# EAGLE design External_Battery (EAGLE 9.2.0)
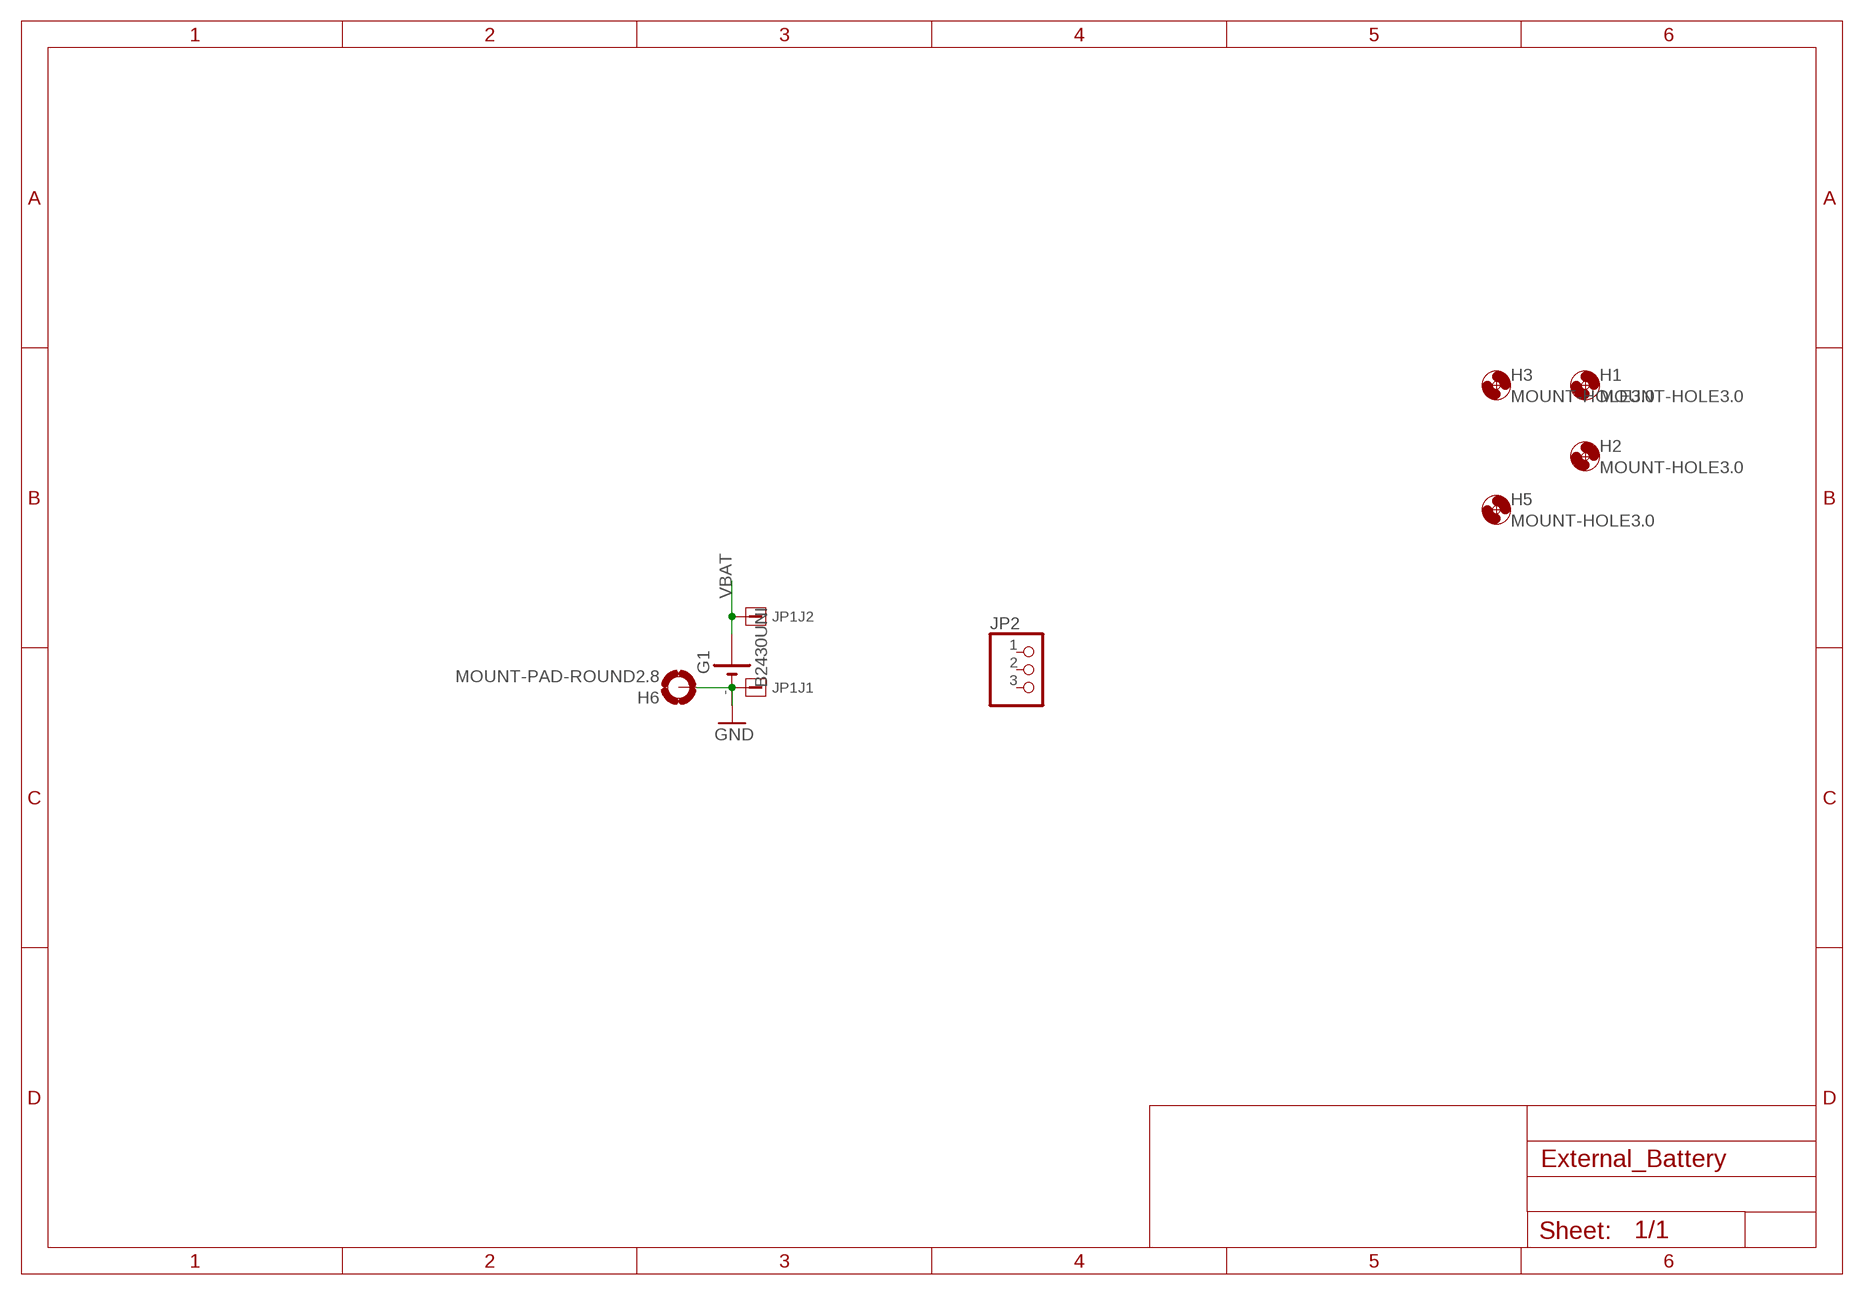
[diagram p0: schematic, sheet 1]

## Parts
G1  B2430UNI  [B2430UNI]
H1  MOUNT-HOLE3.0  [3,0]
H2  MOUNT-HOLE3.0  [3,0]
H3  MOUNT-HOLE3.0  [3,0]
H5  MOUNT-HOLE3.0  [3,0]
H6  MOUNT-PAD-ROUND2.8  [2,8-PAD]
JP1  CON2-3.81  [CON2-3.81]
JP2  PINHD-1X3  [1X03]

## Nets
GND: G1.- G1.-@1(-) H6.B2,8(MOUNT) JP1.1
VBAT: G1.+@4(+) JP1.2
Unconnected: JP2.1 JP2.2 JP2.3

## Library data of the parts
G1 = battery:B2430UNI: LI BATTERY
H1-H3 H5 = holes:MOUNT-HOLE: MOUNTING HOLE with drill center marker
H6 = holes:MOUNT-PAD-ROUND: MOUNTING PAD, round
JP1 = IyunLib:CON2-3.81
JP2 = pinhead:PINHD-1X3: PIN HEADER

## Board
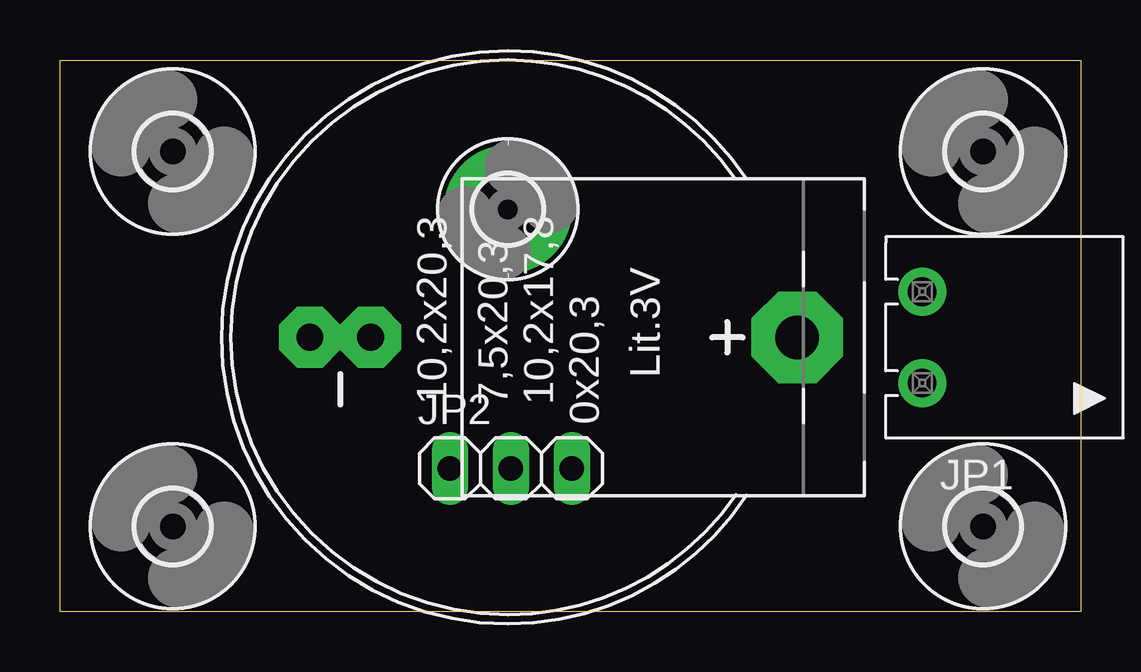
[diagram p1: board, top side]
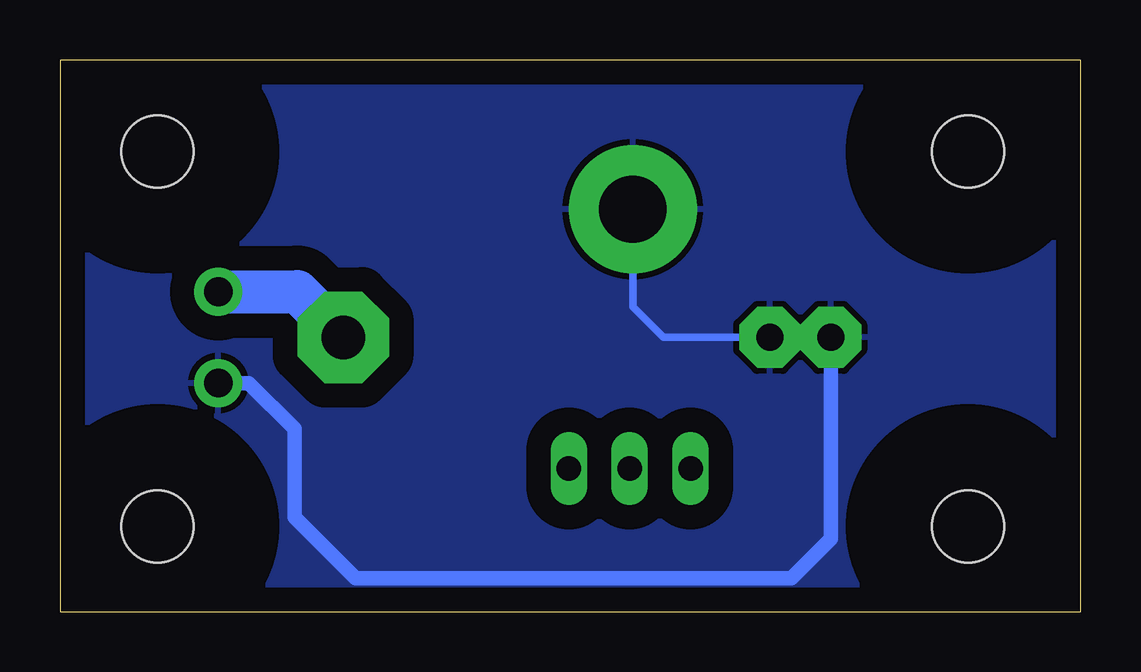
[diagram p2: board, bottom side, seen from below]

Size 42.55 x 22.99 mm. Coordinates in mm from the lower left corner, seen from the top.
Outline: 42.55,22.99 42.55,0 0,0 0,22.99 42.55,22.99
Copper layers (1*16): Top 0.035mm / dielectric 1.5mm / Bottom 0.035mm
Design rules "default": minimum track width 10mil, minimum drill 24mil, track to track 8mil, track to pad 8mil, pad to pad 8mil, via to via 8mil, smd to smd 8mil, copper to edge 40mil, drill to drill 8mil, minimum pad ring 10mil, minimum via ring 8mil, stop-mask expansion 4mil, vias tented up to drill 0mil, thermal gap 10mil

### Footprints (pad centres in the part's own frame; a part is rotated, then mirrored left to right if it is on the bottom)
B2430UNI = drill 1.803 pad 3.81 octagon: +@4 0,12.065 | drill 1.118 pad 2.54 octagon: - 0,-5.715; -@1 0,-8.255
3,0 = hole 3: 0,0
2,8-PAD = drill 2.8 pad 5.334: B2,8 0,0
CON2-3.81 = drill 1.2 pad 2: 1 -2.54,0; 2 1.27,0
1X03 = drill 1.016 long: 1 -2.54,0; 2 0,0; 3 2.54,0

### Placement (x,y rotation side)
G1  18.67,11.43 270 top
H1  4.7,19.18 270 top
H2  38.48,3.56 270 top
H3  38.48,19.18 270 top
H5  4.7,3.56 270 top
H6  18.67,16.76 0 top
JP1  35.94,12.06 90 top
JP2  18.8,5.97 0 top

### Tracks (layer width: path | path; a pad name or v marks a point on that pad's centre or on a via)
GND
  Bottom 0.305: G1.- 17.4,11.43 18.67,12.7 H6.B2,8
  Bottom 0.61: G1.- G1.-@1 10.41,3.05 12.06,1.4 30.23,1.4 32.77,3.94 32.77,7.62 34.67,9.53 JP1.1
  pour Bottom (isolate 1.016): 42.29,22.73 42.29,0.13 0.25,0.13 0.25,22.73
VBAT
  Bottom 1.8: JP1.2 32.64,13.34 G1.+@4